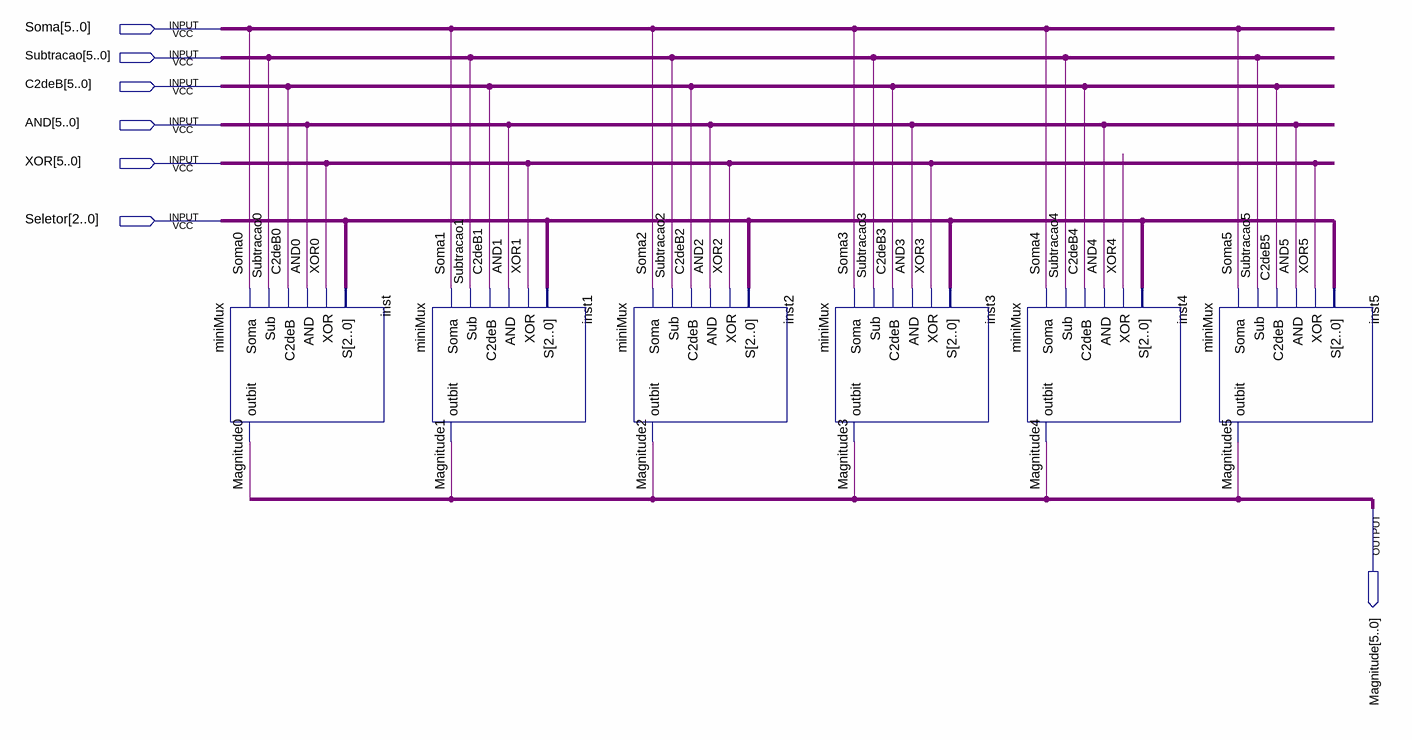
[diagram p0: schematic sheet]
// Quartus schematic MuxMagnitude.bdf as structural Verilog: 6 symbols, 7 pins
module MuxMagnitude (
  input  [5:0] Soma,
  input  [5:0] Subtracao,
  input  [5:0] C2deB,
  input  [5:0] AND,
  input  [5:0] XOR,
  input  [2:0] Seletor,
  output [5:0] Magnitude
);

  miniMux inst (
    .Soma(Soma[0]), .Sub(Subtracao[0]), .C2deB(C2deB[0]), .AND(AND[0]), .XOR(XOR[0]), .S(Seletor),
    .outbit(Magnitude[0]));
  miniMux inst1 (
    .Soma(Soma[1]), .Sub(Subtracao[1]), .C2deB(C2deB[1]), .AND(AND[1]), .XOR(XOR[1]), .S(Seletor),
    .outbit(Magnitude[1]));
  miniMux inst2 (
    .Soma(Soma[2]), .Sub(Subtracao[2]), .C2deB(C2deB[2]), .AND(AND[2]), .XOR(XOR[2]), .S(Seletor),
    .outbit(Magnitude[2]));
  miniMux inst3 (
    .Soma(Soma[3]), .Sub(Subtracao[3]), .C2deB(C2deB[3]), .AND(AND[3]), .XOR(XOR[3]), .S(Seletor),
    .outbit(Magnitude[3]));
  miniMux inst4 (
    .Soma(Soma[4]), .Sub(Subtracao[4]), .C2deB(C2deB[4]), .AND(AND[4]), .XOR(XOR[4]), .S(Seletor),
    .outbit(Magnitude[4]));
  miniMux inst5 (
    .Soma(Soma[5]), .Sub(Subtracao[5]), .C2deB(C2deB[5]), .AND(AND[5]), .XOR(XOR[5]), .S(Seletor),
    .outbit(Magnitude[5]));
endmodule
